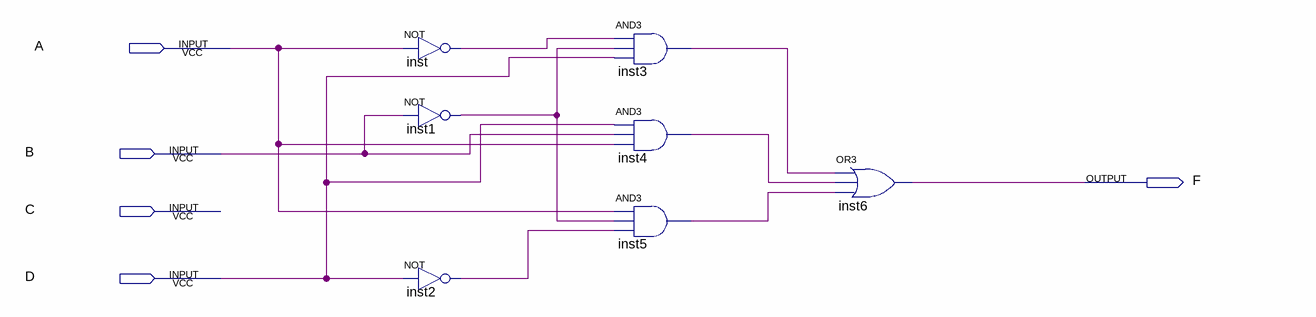
[diagram p0: schematic sheet]
// Quartus schematic LAB2_1.bdf as structural Verilog: 7 symbols, 5 pins
module LAB2_1 (
  input  A,
  input  B,
  input  C,
  input  D,
  output F
);

  wire inst1_out, inst2_out, inst3_out, inst4_out, inst5_out, inst_out;

  not inst (inst_out, A);
  not inst1 (inst1_out, B);
  not inst2 (inst2_out, D);
  and inst3 (inst3_out, inst_out, inst1_out, D);
  and inst4 (inst4_out, D, B, A);
  and inst5 (inst5_out, A, inst1_out, inst2_out);
  or inst6 (F, inst3_out, inst4_out, inst5_out);
endmodule
